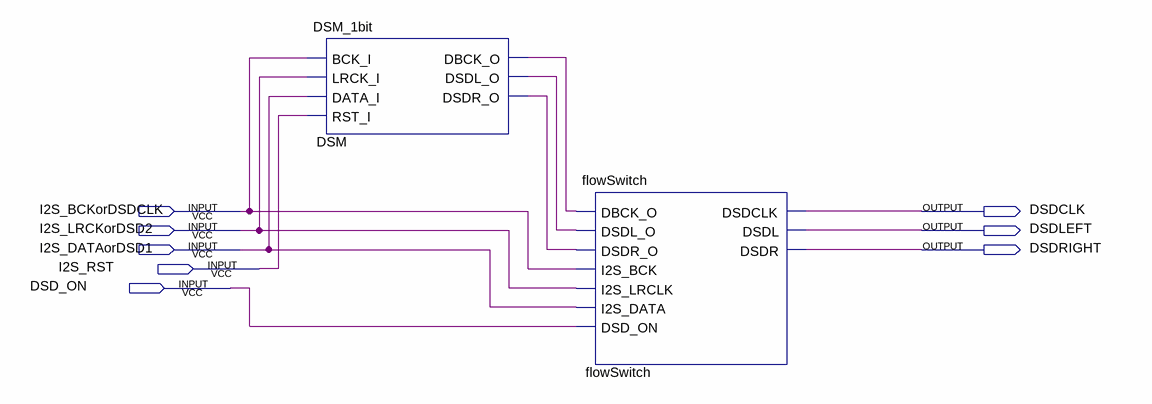
[diagram p0: schematic sheet]
// Quartus schematic topLevel.bdf as structural Verilog: 2 symbols, 8 pins
module topLevel (
  input  I2S_BCKorDSDCLK,
  input  I2S_LRCKorDSD2,
  input  I2S_DATAorDSD1,
  input  I2S_RST,
  input  DSD_ON,
  output DSDCLK,
  output DSDLEFT,
  output DSDRIGHT
);

  wire DSM_dbck_o, DSM_dsdl_o, DSM_dsdr_o;

  DSM_1bit DSM (
    .BCK_I(I2S_BCKorDSDCLK), .LRCK_I(I2S_LRCKorDSD2), .DATA_I(I2S_DATAorDSD1), .RST_I(I2S_RST),
    .DBCK_O(DSM_dbck_o), .DSDL_O(DSM_dsdl_o), .DSDR_O(DSM_dsdr_o));
  flowSwitch flowSwitch (
    .DBCK_O(DSM_dbck_o), .DSDL_O(DSM_dsdl_o), .DSDR_O(DSM_dsdr_o), .I2S_BCK(I2S_BCKorDSDCLK),
    .I2S_LRCLK(I2S_LRCKorDSD2), .I2S_DATA(I2S_DATAorDSD1), .DSD_ON(DSD_ON), .DSDCLK(DSDCLK), .DSDL(DSDLEFT),
    .DSDR(DSDRIGHT));
endmodule
